# Altium schematic sheet NB2_CommonMemory_Termination.SchDoc: Memory CommonBus Terminations
size A3; SheetNumber: 19; SheetTotal: 19; PageSetup: Record=PageOptions|CenterHorizontal=True|CenterVertical=True|PrintScale=0.71|XCorrection=1.00|YCorrection=1.00|PrintKind=0|BorderSize=5000000|LeftOffset=0|BottomOffset=0|Orientation=2|PaperLength=1000|PaperWidth=1000|Scale=100|PaperSource=15|PrintQuality=600|MediaType=1|DitherType=10|PaperKind=A4|PrintScaleMode=1
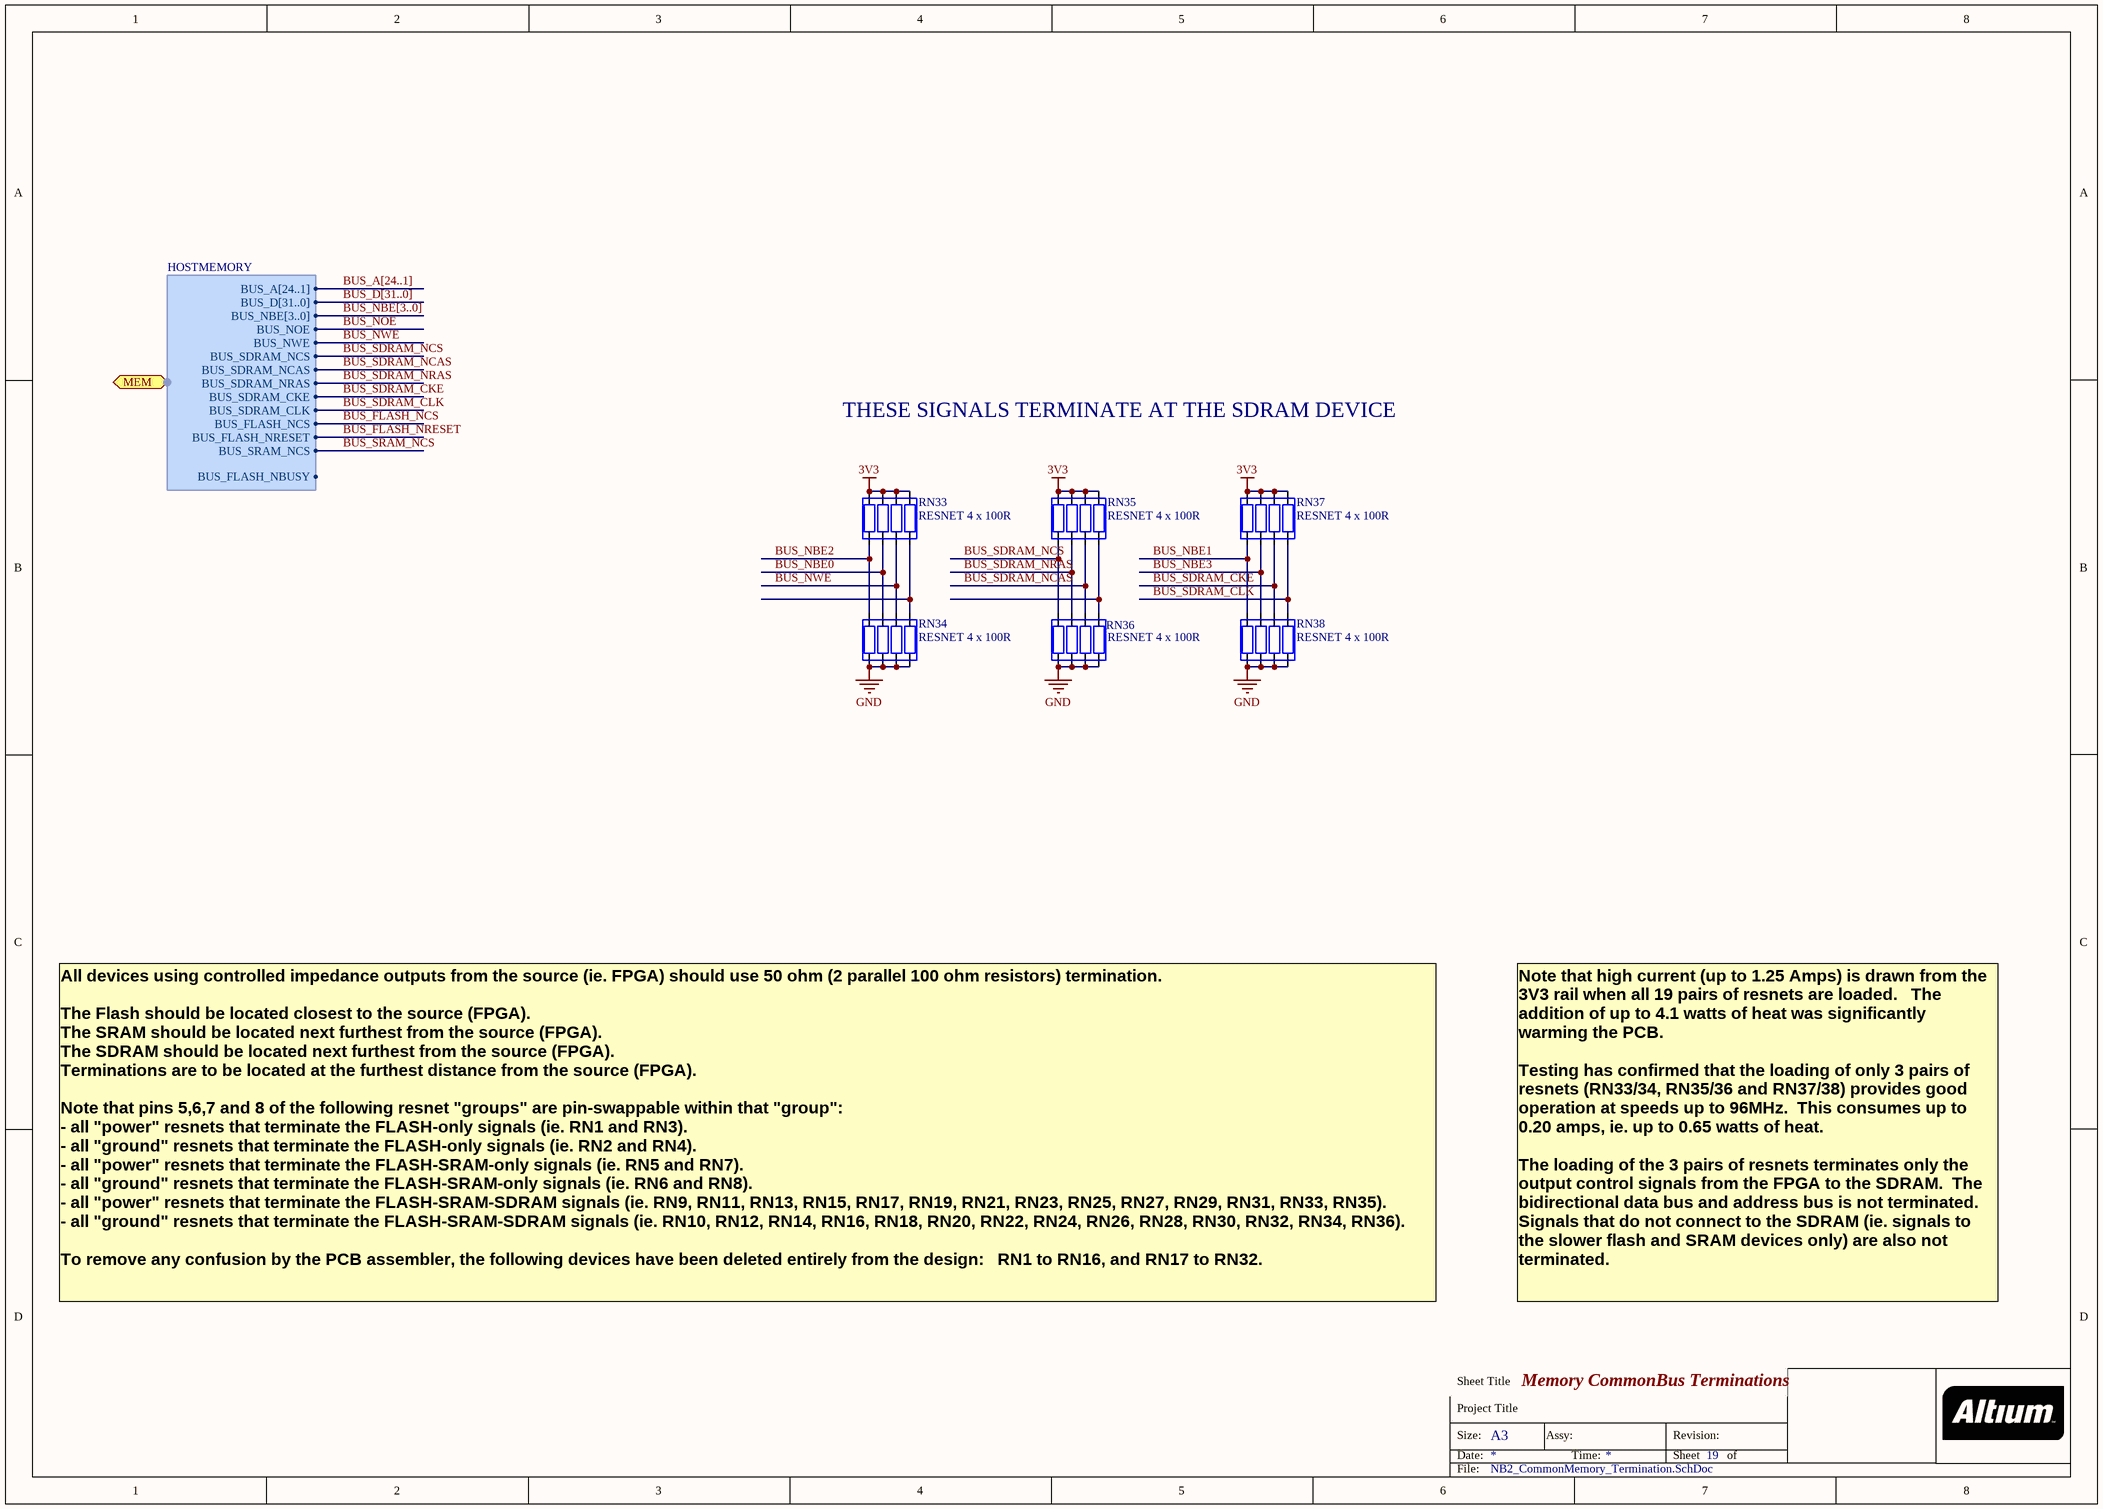
[diagram p0: NB2_CommonMemory_Termination.SchDoc]

## Parts
RN33  RESNET 4 x 100R  [RESNET-1005X4]
RN34  RESNET 4 x 100R  [RESNET-1005X4]
RN35  RESNET 4 x 100R  [RESNET-1005X4]
RN36  RESNET 4 x 100R  [RESNET-1005X4]
RN37  RESNET 4 x 100R  [RESNET-1005X4]
RN38  RESNET 4 x 100R  [RESNET-1005X4]

## Ports
MEM (harness HOSTMEMORY)

## Harnesses
HOSTMEMORY: BUS_SRAM_NCS, BUS_SDRAM_NCAS, BUS_SDRAM_NRAS, BUS_SDRAM_CKE, BUS_SDRAM_CLK, BUS_FLASH_NCS, BUS_FLASH_NRESET, BUS_FLASH_NBUSY, BUS_A[24..1], BUS_D[31..0], BUS_NBE[3..0], BUS_NOE, BUS_NWE, BUS_SDRAM_NCS

## Nets
3V3: RN33.1 RN33.2 RN33.3 RN33.4 RN35.1 RN35.2 RN35.3 RN35.4 RN37.1 RN37.2 RN37.3 RN37.4
GND: RN34.1 RN34.2 RN34.3 RN34.4 RN36.1 RN36.2 RN36.3 RN36.4 RN38.1 RN38.2 RN38.3 RN38.4
BUS_FLASH_NCS: port MEM.BUS_FLASH_NCS
BUS_FLASH_NRESET: port MEM.BUS_FLASH_NRESET
BUS_NBE0: RN33.6 RN34.7
BUS_NBE1: RN37.5 RN38.8
BUS_NBE2: RN33.5 RN34.8
BUS_NBE3: RN37.6 RN38.7
BUS_NOE: port MEM.BUS_NOE
BUS_NWE: RN33.7 RN34.6 ; port MEM.BUS_NWE
BUS_SDRAM_CKE: RN37.7 RN38.6 ; port MEM.BUS_SDRAM_CKE
BUS_SDRAM_CLK: RN37.8 RN38.5 ; port MEM.BUS_SDRAM_CLK
BUS_SDRAM_NCAS: RN35.7 RN36.6 ; port MEM.BUS_SDRAM_NCAS
BUS_SDRAM_NCS: RN35.5 RN36.8 ; port MEM.BUS_SDRAM_NCS
BUS_SDRAM_NRAS: RN35.6 RN36.7 ; port MEM.BUS_SDRAM_NRAS
BUS_SRAM_NCS: port MEM.BUS_SRAM_NCS
NetRN33_8: RN33.8 RN34.5
NetRN35_8: RN35.8 RN36.5

## Buses and harness runs
bus BUS_A[24..1]
bus BUS_D[31..0]
bus BUS_NBE[3..0]

## Notes on the sheet
- THESE SIGNALS TERMINATE AT THE SDRAM DEVICE
- All devices using controlled impedance outputs from the source (ie. FPGA) should use 50 ohm (2 parallel 100 ohm resistors) termination.
  The Flash should be located closest to the source (FPGA).
  The SRAM should be located next furthest from the source (FPGA).
  The SDRAM should be located next furthest from the source (FPGA).
  Terminations are to be located at the furthest distance from the source (FPGA).
  Note that pins 5,6,7 and 8 of the following resnet "groups" are pin-swappable within that "group":
  - all "power" resnets that terminate the FLASH-only signals (ie. RN1 and RN3).
  - all "ground" resnets that terminate the FLASH-only signals (ie. RN2 and RN4).
  - all "power" resnets that terminate the FLASH-SRAM-only signals (ie. RN5 and RN7).
  - all "ground" resnets that terminate the FLASH-SRAM-only signals (ie. RN6 and RN8).
  - all "power" resnets that terminate the FLASH-SRAM-SDRAM signals (ie. RN9, RN11, RN13, RN15, RN17, RN19, RN21, RN23, RN25, RN27, RN29, RN31, RN33, RN35).
  - all "ground" resnets that terminate the FLASH-SRAM-SDRAM signals (ie. RN10, RN12, RN14, RN16, RN18, RN20, RN22, RN24, RN26, RN28, RN30, RN32, RN34, RN36).
  To remove any confusion by the PCB assembler, the following devices have been deleted entirely from the design:   RN1 to RN16, and RN17 to RN32.
- Note that high current (up to 1.25 Amps) is drawn from the 3V3 rail when all 19 pairs of resnets are loaded.   The addition of up to 4.1 watts of heat was significantly warming the PCB.
  Testing has confirmed that the loading of only 3 pairs of resnets (RN33/34, RN35/36 and RN37/38) provides good operation at speeds up to 96MHz.  This consumes up to 0.20 amps, ie. up to 0.65 watts of heat.
  The loading of the 3 pairs of resnets terminates only the output control signals from the FPGA to the SDRAM.  The bidirectional data bus and address bus is not terminated.  Signals that do not connect to the SDRAM (ie. signals to the slower flash and SRAM devices only) are also not terminated.
- Sheet Title
- Project Title
- Size:
- Date:
- A3
- Assy:
- Time:
- Revision:
- Sheet
- of
- File:

## Library data of the parts
RN33-RN38 = D-104-0001: Resistor Network, Isolated, 4 x 100R, 5%, SMD 0402 x 4; Power Rating: 63 mW; Mounting Technology: Surface Mount; Resistance: 100 R; Status: Unreleased; Tolerance: 5 %; Category: Resistor-Network